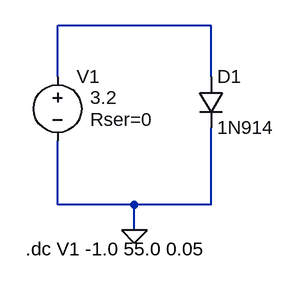
[diagram p0: schematic 1N914.asc]
1N914.asc, the LTspice schematic file:
Version 4
SHEET 1 880 680
WIRE 256 80 64 80
WIRE 64 144 64 80
WIRE 256 144 256 80
WIRE 64 304 64 224
WIRE 160 304 64 304
WIRE 256 304 256 208
WIRE 256 304 160 304
WIRE 160 336 160 304
FLAG 160 336 0
SYMBOL voltage 64 128 R0
WINDOW 3 41 42 Left 2
WINDOW 123 0 0 Left 0
WINDOW 39 41 70 Left 2
SYMATTR InstName V1
SYMATTR Value 3.2
SYMATTR SpiceLine Rser=0
SYMBOL diode 240 144 R0
SYMATTR InstName D1
SYMATTR Value 1N914
TEXT 24 360 Left 2 !.dc V1 -1.0 55.0 0.05

The netlist it stands for:
* 1N914.asc
V1 N001 0 3.2 Rser=0
D1 N001 0 1N914
.model D D
.lib standard.dio
.dc V1 -1.0 55.0 0.05
.backanno
.end